# EAGLE schematic harness_set (EAGLE 7.4.0)
DOC_NUM: DR20000194; DOC_TITLE: ER-524D cable harness; REV: 00
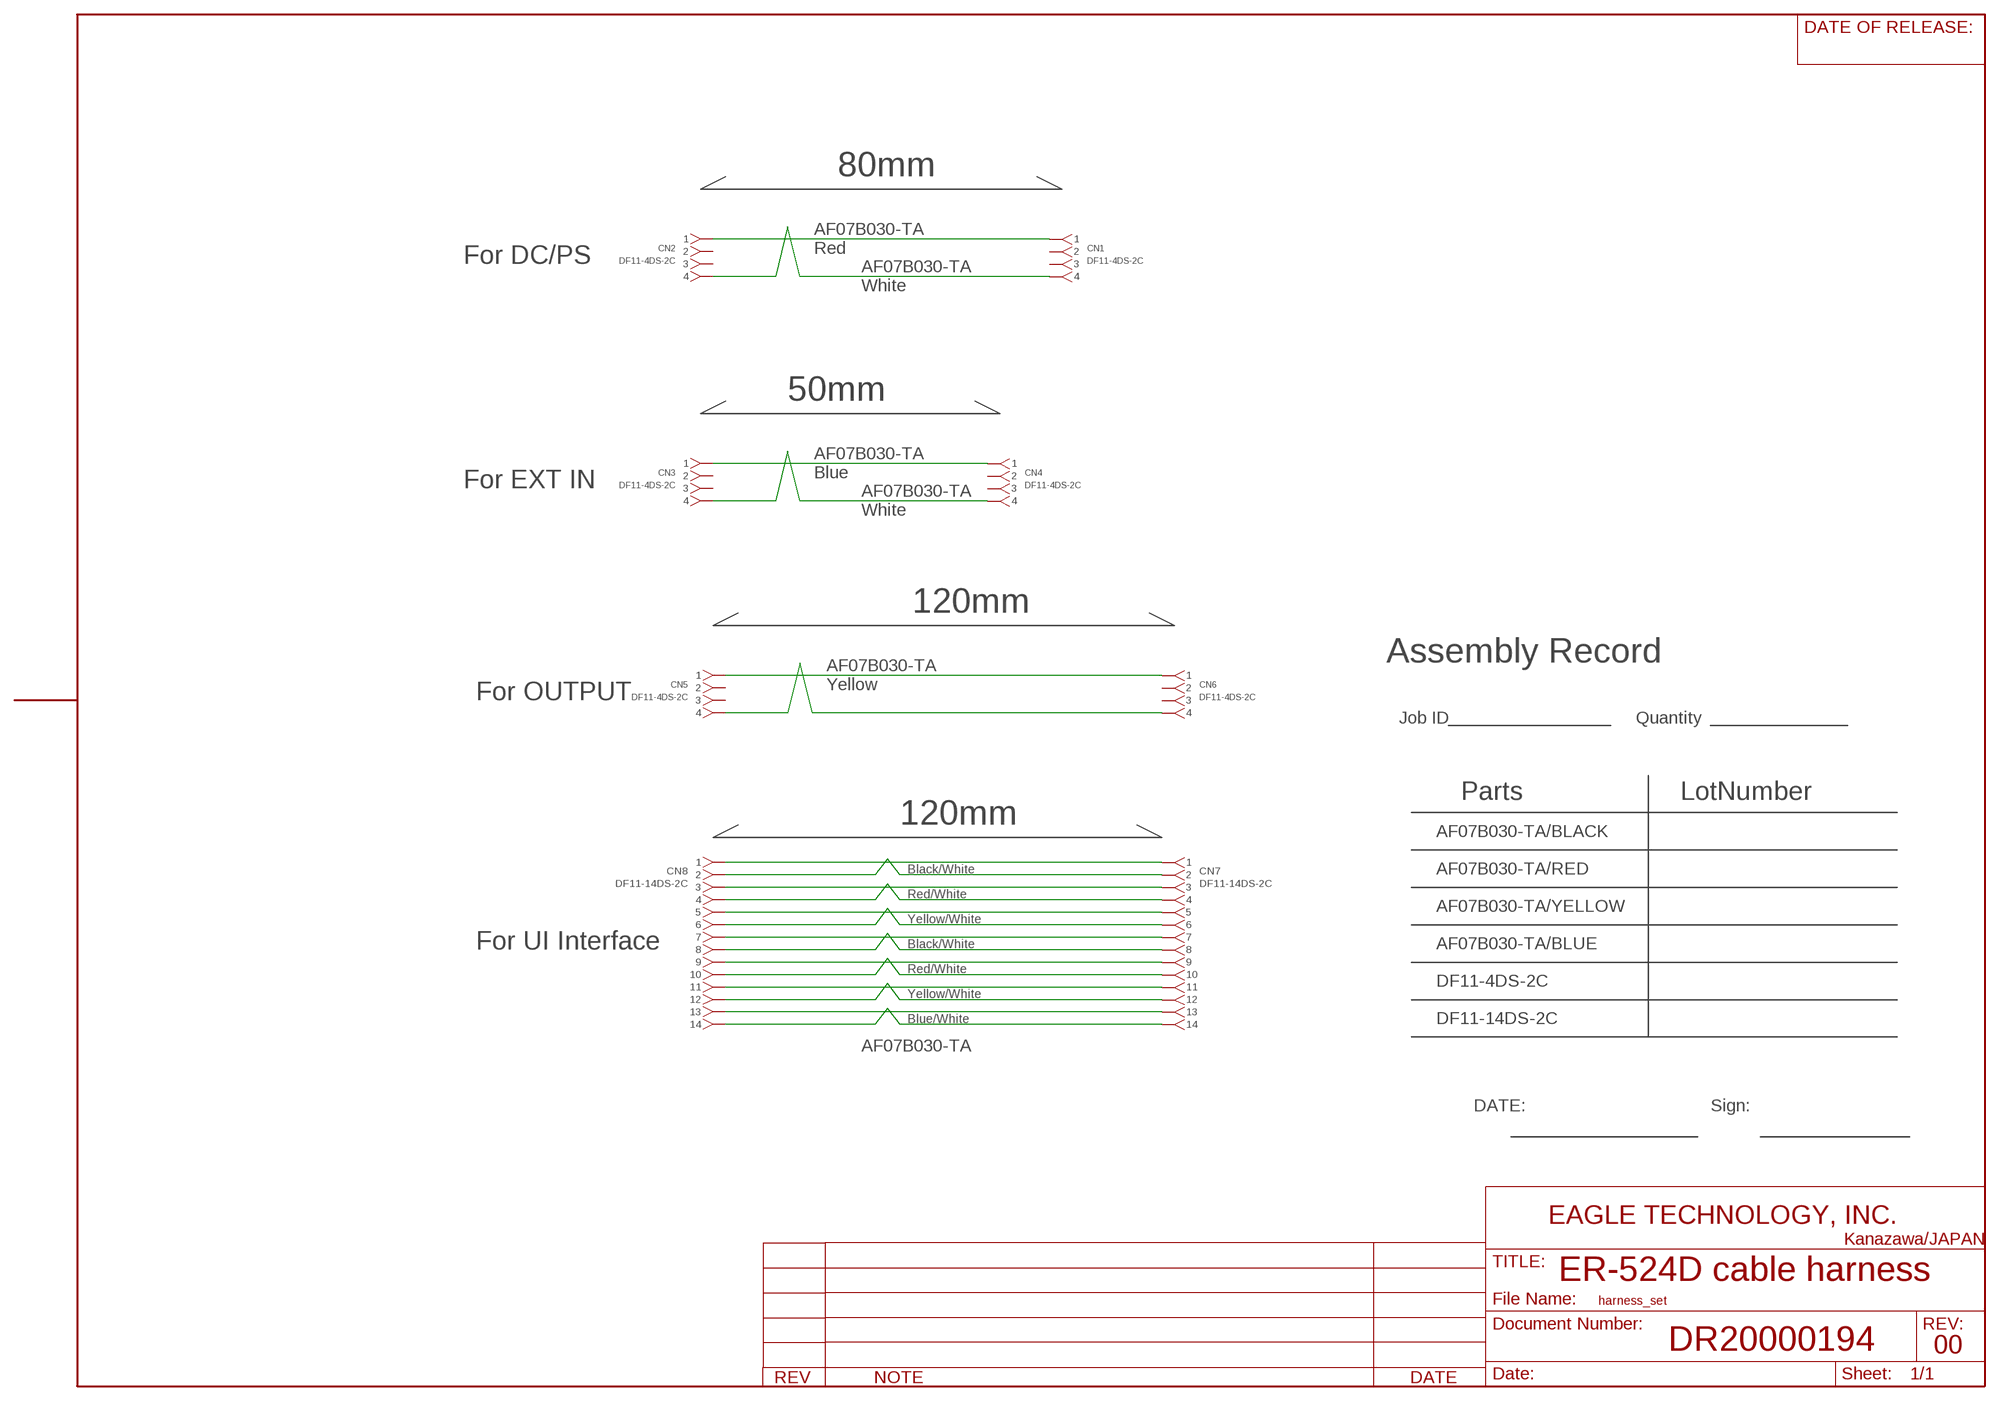
[diagram p0: schematic, sheet 1]

## Parts
CN1  DF11-4DS-2C  [DF11-4DP-2DS]
CN2  DF11-4DS-2C  [DF11-4DP-2DS]
CN3  DF11-4DS-2C  [DF11-4DP-2DS]
CN4  DF11-4DS-2C  [DF11-4DP-2DS]
CN5  DF11-4DS-2C  [DF11-4DP-2DS]
CN6  DF11-4DS-2C  [DF11-4DP-2DS]
CN7  DF11-14DS-2C  [DF11-14DS-2DSA]
CN8  DF11-14DS-2C  [DF11-14DS-2DSA]

## Nets
N$1: CN1.1 CN2.1 CN3.1 CN4.1
N$2: CN3.4 CN4.4
N$3: CN5.1
N$4: CN1.4 CN2.4
N$5: CN5.4
N$6: CN7.1 CN8.1
N$7: CN7.2 CN8.2
N$8: CN7.3 CN8.3
N$9: CN7.4
N$10: CN7.5 CN8.5
N$12: CN7.7 CN8.7
N$13: CN7.6
N$14: CN7.9 CN8.9
N$15: CN7.8
N$16: CN7.11 CN8.11
N$17: CN7.10
N$18: CN7.13 CN8.13
N$19: CN7.12
N$20: CN7.14
Unconnected: CN1.2 CN1.3 CN2.2 CN2.3 CN3.2 CN3.3 CN4.2 CN4.3 CN5.2 CN5.3 CN6.1 CN6.2 CN6.3 CN6.4 CN8.4 CN8.6 CN8.8 CN8.10 CN8.12 CN8.14

## Notes on the sheet
- 80mm
- AF07B030-TA
  Red
- For DC/PS
- AF07B030-TA
  White
- 50mm
- AF07B030-TA
  Blue
- For EXT IN
- AF07B030-TA
  White
- 120mm
- Assembly Record
- AF07B030-TA
  Yellow
- For OUTPUT
- Job ID | Quantity
- Parts                     LotNumber
- 120mm
- AF07B030-TA/BLACK
- Black/White | AF07B030-TA/RED
- Red/White
- AF07B030-TA/YELLOW
- Yellow/White
- For UI Interface | Black/White | AF07B030-TA/BLUE
- Red/White
- DF11-4DS-2C
- Yellow/White
- Blue/White | DF11-14DS-2C
- AF07B030-TA
- DATE: | Sign:

## Library data of the parts
CN1-CN6 = AEL_terminal:DF11-4DS-2C: DF-11 4pin Socket on cable DF11-4DS-2C + DC11-30SC x 4
CN7 CN8 = AEL_terminal:DF11-14DS-2C: DF-11 14pin Socket for cable DF11-14DS-2C + DC11-30SC x 14